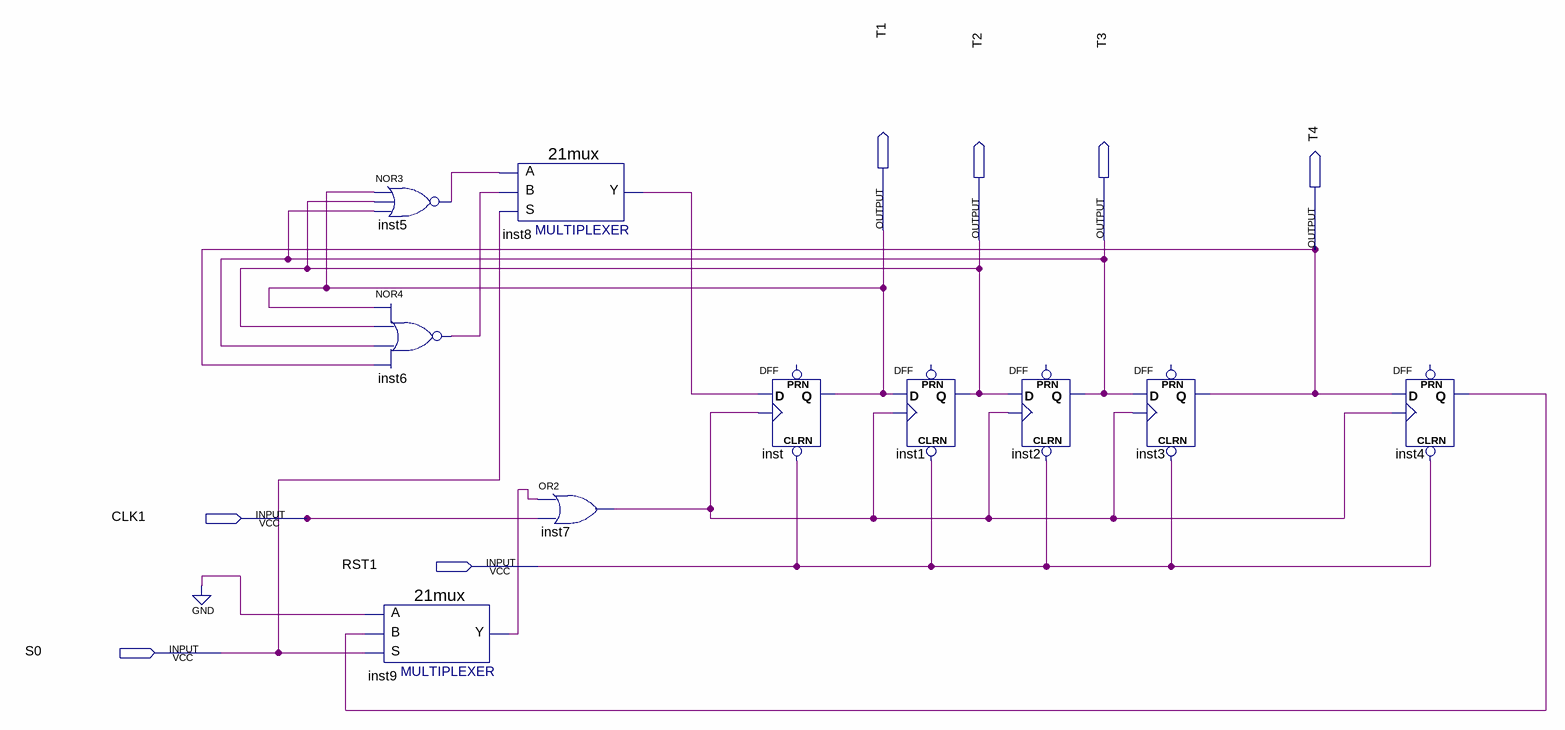
[diagram p0: schematic sheet]
// Quartus schematic TASK3.bdf as structural Verilog: 10 symbols, 7 pins
module TASK3 (
  input  CLK1,
  input  RST1,
  input  S0,
  output T1,
  output T2,
  output T3,
  output T4
);

  wire inst4_q, inst5_out, inst6_out, inst7_out, inst8_y, inst9_y;

  nor inst5 (inst5_out, T1, T2, T3);
  nor inst6 (inst6_out, T1, T2, T3, T4);
  \21mux  inst9 (.S(S0), .B(inst4_q), .A(1'b0), .Y(inst9_y));
  \21mux  inst8 (.S(S0), .B(inst6_out), .A(inst5_out), .Y(inst8_y));
  or inst7 (inst7_out, inst9_y, CLK1);
  DFF inst (.CLRN(RST1), .CLK(inst7_out), .D(inst8_y), .Q(T1));  // open: PRN
  DFF inst1 (.CLRN(RST1), .CLK(inst7_out), .D(T1), .Q(T2));  // open: PRN
  DFF inst2 (.CLRN(RST1), .CLK(inst7_out), .D(T2), .Q(T3));  // open: PRN
  DFF inst3 (.CLRN(RST1), .CLK(inst7_out), .D(T3), .Q(T4));  // open: PRN
  DFF inst4 (.CLRN(RST1), .CLK(inst7_out), .D(T4), .Q(inst4_q));  // open: PRN
endmodule
